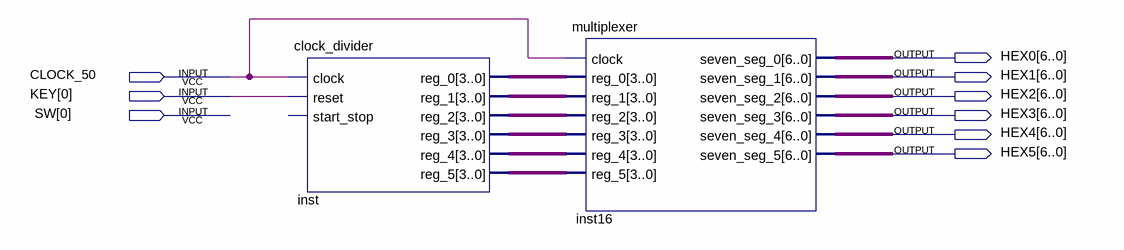
[diagram p0: schematic sheet]
// Quartus schematic top.bdf as structural Verilog: 2 symbols, 9 pins
module top (
  input  CLOCK_50,
  input  [0:0] KEY,
  input  [0:0] SW,
  output [6:0] HEX0,
  output [6:0] HEX1,
  output [6:0] HEX2,
  output [6:0] HEX3,
  output [6:0] HEX4,
  output [6:0] HEX5
);

  wire [3:0] inst_reg_0, inst_reg_1, inst_reg_2, inst_reg_3, inst_reg_4, inst_reg_5;

  clock_divider inst (
    .clock(CLOCK_50), .reset(KEY[0]), .reg_0(inst_reg_0), .reg_1(inst_reg_1), .reg_2(inst_reg_2),
    .reg_3(inst_reg_3), .reg_4(inst_reg_4), .reg_5(inst_reg_5));  // open: start_stop
  multiplexer inst16 (
    .clock(CLOCK_50), .reg_0(inst_reg_0), .reg_1(inst_reg_1), .reg_2(inst_reg_2), .reg_3(inst_reg_3),
    .reg_4(inst_reg_4), .reg_5(inst_reg_5), .seven_seg_0(HEX0), .seven_seg_1(HEX1), .seven_seg_2(HEX2),
    .seven_seg_3(HEX3), .seven_seg_4(HEX4), .seven_seg_5(HEX5));
endmodule
